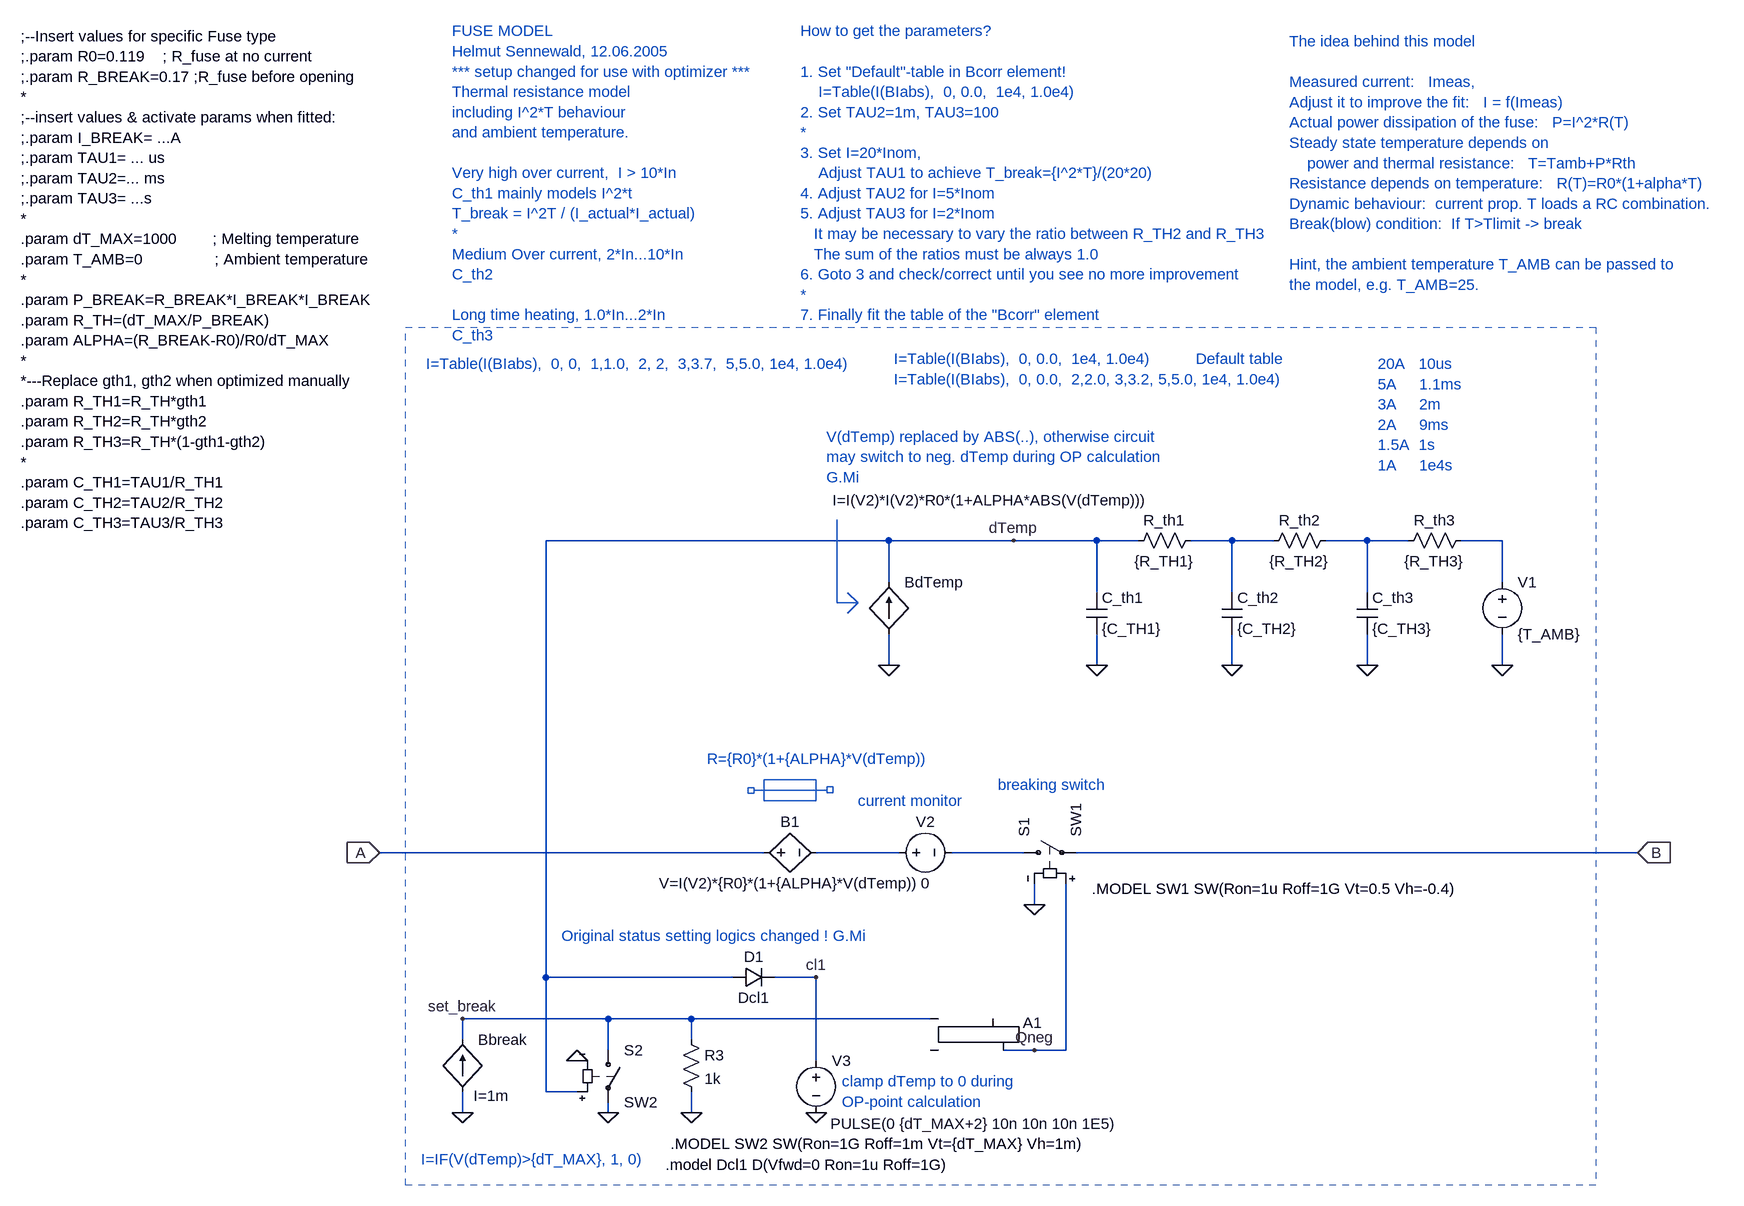
[diagram p0: schematic Fuse_Model_NN.asc]
Fuse_Model_NN.asc, the LTspice schematic file:
Version 4
SHEET 1 2036 932
WIRE -96 368 -96 336
WIRE -96 480 -96 448
WIRE 32 272 32 -400
WIRE 32 448 32 272
WIRE 80 448 32 448
WIRE 128 336 -96 336
WIRE 128 384 128 336
WIRE 128 480 128 464
WIRE 256 336 128 336
WIRE 256 368 256 336
WIRE 256 480 256 448
WIRE 320 272 32 272
WIRE 368 80 -224 80
WIRE 448 272 384 272
WIRE 448 400 448 272
WIRE 560 -400 32 -400
WIRE 560 -336 560 -400
WIRE 560 -208 560 -256
WIRE 576 80 448 80
WIRE 624 336 256 336
WIRE 752 -400 560 -400
WIRE 768 80 656 80
WIRE 784 160 784 128
WIRE 784 384 736 384
WIRE 832 384 784 384
WIRE 832 384 832 128
WIRE 880 -400 752 -400
WIRE 880 -320 880 -400
WIRE 880 -208 880 -256
WIRE 944 -400 880 -400
WIRE 1088 -400 1024 -400
WIRE 1088 -320 1088 -400
WIRE 1088 -208 1088 -256
WIRE 1152 -400 1088 -400
WIRE 1296 -400 1232 -400
WIRE 1296 -320 1296 -400
WIRE 1296 -208 1296 -256
WIRE 1360 -400 1296 -400
WIRE 1504 -400 1440 -400
WIRE 1504 -336 1504 -400
WIRE 1504 -208 1504 -256
WIRE 1712 80 848 80
FLAG 560 -208 0
FLAG 784 160 0
FLAG 752 -400 dTemp
FLAG 880 -208 0
FLAG 1296 -208 0
FLAG 1088 -208 0
FLAG -96 480 0
FLAG 256 480 0
FLAG -96 336 set_break
FLAG 1504 -208 0
FLAG -224 80 A
IOPIN -224 80 In
FLAG 1712 80 B
IOPIN 1712 80 In
FLAG 784 384 Qneg
FLAG 128 480 0
FLAG 448 480 0
FLAG 80 400 0
FLAG 448 272 cl1
SYMBOL voltage 560 80 R270
WINDOW 0 32 56 VTop 0
WINDOW 3 -32 56 VBottom 0
SYMATTR InstName V2
SYMATTR Value 0
SYMBOL bi2 560 -336 R0
WINDOW 3 -87 -126 Left 0
SYMATTR Value I=I(V2)*I(V2)*R0*(1+ALPHA*ABS(V(dTemp)))
SYMATTR InstName BdTemp
SYMBOL res 928 -384 R270
WINDOW 0 32 56 VTop 0
WINDOW 3 0 56 VBottom 0
SYMATTR InstName R_th1
SYMATTR Value {R_TH1}
SYMBOL cap 864 -320 R0
SYMATTR InstName C_th1
SYMATTR Value {C_TH1}
SYMBOL sw 752 80 R270
SYMATTR InstName S1
SYMATTR Value SW1
SYMBOL res 1136 -384 R270
WINDOW 0 32 56 VTop 0
WINDOW 3 0 56 VBottom 0
SYMATTR InstName R_th2
SYMATTR Value {R_TH2}
SYMBOL cap 1072 -320 R0
SYMATTR InstName C_th2
SYMATTR Value {C_TH2}
SYMBOL Digital\\srflop 672 288 R0
SYMATTR InstName A1
SYMBOL cap 1280 -320 R0
SYMATTR InstName C_th3
SYMATTR Value {C_TH3}
SYMBOL bi2 -96 368 R0
WINDOW 3 17 86 Left 0
SYMATTR Value I=1m
SYMATTR InstName Bbreak
SYMBOL res 240 352 R0
SYMATTR InstName R3
SYMATTR Value 1k
SYMBOL res 1344 -384 R270
WINDOW 0 32 56 VTop 0
WINDOW 3 0 56 VBottom 0
SYMATTR InstName R_th3
SYMATTR Value {R_TH3}
SYMBOL bv 352 80 R270
WINDOW 0 32 56 VTop 0
WINDOW 3 -32 56 VBottom 0
SYMATTR InstName B1
SYMATTR Value V=I(V2)*{R0}*(1+{ALPHA}*V(dTemp))
SYMBOL voltage 1504 -352 R0
SYMATTR InstName V1
SYMATTR Value {T_AMB}
SYMBOL sw 128 368 R0
SYMATTR InstName S2
SYMATTR Value SW2
SYMBOL voltage 448 384 R0
WINDOW 123 0 0 Left 0
WINDOW 39 0 0 Left 0
WINDOW 3 22 113 Left 0
SYMATTR Value PULSE(0 {dT_MAX+2} 10n 10n 10n 1E5)
SYMATTR InstName V3
SYMBOL diode 320 288 R270
WINDOW 0 32 32 VTop 0
WINDOW 3 0 32 VBottom 0
SYMATTR InstName D1
SYMATTR Value Dcl1
TEXT 872 136 Left 0 !.MODEL SW1 SW(Ron=1u Roff=1G Vt=0.5 Vh=-0.4)
TEXT -112 -1184 Left 0 ;FUSE MODEL\nHelmut Sennewald, 12.06.2005\n*** setup changed for use with optimizer ***\nThermal resistance model \nincluding I^2*T behaviour \nand ambient temperature.\n \nVery high over current,  I > 10*In\nC_th1 mainly models I^2*t \nT_break = I^2T / (I_actual*I_actual)\n*\nMedium Over current, 2*In...10*In\nC_th2 \n \nLong time heating, 1.0*In...2*In\nC_th3
TEXT 568 -648 Left 0 ;I=Table(I(BIabs),  0, 0.0,  2,2.0, 3,3.2, 5,5.0, 1e4, 1.0e4)
TEXT 568 -680 Left 0 ;I=Table(I(BIabs),  0, 0.0,  1e4, 1.0e4)
TEXT 1032 -680 Left 0 ;Default table
TEXT 280 -64 Left 0 ;R={R0}*(1+{ALPHA}*V(dTemp))
TEXT 512 0 Left 0 ;current monitor
TEXT 728 -24 Left 0 ;breaking switch
TEXT 424 -1184 Left 0 ;How to get the parameters?\n \n1. Set "Default"-table in Bcorr element!\n    I=Table(I(BIabs),  0, 0.0,  1e4, 1.0e4)\n2. Set TAU2=1m, TAU3=100\n*\n3. Set I=20*Inom, \n    Adjust TAU1 to achieve T_break={I^2*T}/(20*20)\n4. Adjust TAU2 for I=5*Inom\n5. Adjust TAU3 for I=2*Inom\n   It may be necessary to vary the ratio between R_TH2 and R_TH3\n   The sum of the ratios must be always 1.0\n6. Goto 3 and check/correct until you see no more improvement\n*\n7. Finally fit the table of the "Bcorr" element
TEXT -776 -1176 Left 0 !;--Insert values for specific Fuse type\n;.param R0=0.119    ; R_fuse at no current\n;.param R_BREAK=0.17 ;R_fuse before opening\n*\n;--insert values & activate params when fitted:\n;.param I_BREAK= ...A\n;.param TAU1= ... us\n;.param TAU2=... ms\n;.param TAU3= ...s\n*\n.param dT_MAX=1000        ; Melting temperature\n.param T_AMB=0                ; Ambient temperature\n*\n.param P_BREAK=R_BREAK*I_BREAK*I_BREAK\n.param R_TH=(dT_MAX/P_BREAK)\n.param ALPHA=(R_BREAK-R0)/R0/dT_MAX\n*\n*---Replace gth1, gth2 when optimized manually\n.param R_TH1=R_TH*gth1\n.param R_TH2=R_TH*gth2\n.param R_TH3=R_TH*(1-gth1-gth2)\n*\n.param C_TH1=TAU1/R_TH1\n.param C_TH2=TAU2/R_TH2\n.param C_TH3=TAU3/R_TH3
TEXT -152 -672 Left 0 ;I=Table(I(BIabs),  0, 0,  1,1.0,  2, 2,  3,3.7,  5,5.0, 1e4, 1.0e4)
TEXT 1312 -672 Left 0 ;20A   10us\n5A     1.1ms\n3A     2m\n2A     9ms\n1.5A  1s\n1A     1e4s
TEXT 1176 -1168 Left 0 ;The idea behind this model\n \nMeasured current:   Imeas,       \nAdjust it to improve the fit:   I = f(Imeas)      \nActual power dissipation of the fuse:   P=I^2*R(T) \nSteady state temperature depends on \n    power and thermal resistance:   T=Tamb+P*Rth    \nResistance depends on temperature:   R(T)=R0*(1+alpha*T)   \nDynamic behaviour:  current prop. T loads a RC combination. \nBreak(blow) condition:  If T>Tlimit -> break\n \nHint, the ambient temperature T_AMB can be passed to\nthe model, e.g. T_AMB=25.
TEXT -160 552 Left 0 ;I=IF(V(dTemp)>{dT_MAX}, 1, 0)
TEXT 224 528 Left 0 !.MODEL SW2 SW(Ron=1G Roff=1m Vt={dT_MAX} Vh=1m)
TEXT 216 560 Left 0 !.model Dcl1 D(Vfwd=0 Ron=1u Roff=1G)
TEXT 488 432 Left 0 ;clamp dTemp to 0 during\nOP-point calculation
TEXT 56 208 Left 0 ;Original status setting logics changed ! G.Mi
TEXT 464 -560 Left 0 ;V(dTemp) replaced by ABS(..), otherwise circuit\nmay switch to neg. dTemp during OP calculation\nG.Mi
LINE Normal 480 -432 480 -432
LINE Normal 480 -304 480 -432
LINE Normal 512 -304 480 -304
LINE Normal 496 -320 512 -304
LINE Normal 496 -288 512 -304
LINE Normal 464 -16 352 -16
RECTANGLE Normal 1648 592 -184 -728 2
RECTANGLE Normal 448 0 368 -32
RECTANGLE Normal 474 -12 465 -21
RECTANGLE Normal 352 -11 343 -20

The netlist it stands for:
* Fuse_Model_NN.asc
V2 N001 N002 0
BdTemp 0 dTemp I=I(V2)*I(V2)*R0*(1+ALPHA*ABS(V(dTemp)))
R_th1 dTemp N003 {R_TH1}
C_th1 dTemp 0 {C_TH1}
S1 N002 B Qneg 0 SW1
R_th2 N003 N004 {R_TH2}
C_th2 N003 0 {C_TH2}
A1 set_break 0 0 0 0 Qneg 0 0 SRFLOP
C_th3 N004 0 {C_TH3}
Bbreak 0 set_break I=1m
R3 set_break 0 1k
R_th3 N004 N005 {R_TH3}
B1 A N001 V=I(V2)*{R0}*(1+{ALPHA}*V(dTemp))
V1 N005 0 {T_AMB}
S2 set_break 0 dTemp 0 SW2
V3 cl1 0 PULSE(0 {dT_MAX+2} 10n 10n 10n 1E5)
D1 dTemp cl1 Dcl1
.model D D
.lib standard.dio
.MODEL SW1 SW(Ron=1u Roff=1G Vt=0.5 Vh=-0.4)
* FUSE MODEL
* Helmut Sennewald, 12.06.2005
* *** setup changed for use with optimizer ***
* Thermal resistance model
* including I^2*T behaviour
* and ambient temperature.
* Very high over current,  I > 10*In
* C_th1 mainly models I^2*t
* T_break = I^2T / (I_actual*I_actual)
* *
* Medium Over current, 2*In...10*In
* C_th2
* Long time heating, 1.0*In...2*In
* C_th3
* I=Table(I(BIabs),  0, 0.0,  2,2.0, 3,3.2, 5,5.0, 1e4, 1.0e4)
* I=Table(I(BIabs),  0, 0.0,  1e4, 1.0e4)
* Default table
* R={R0}*(1+{ALPHA}*V(dTemp))
* current monitor
* breaking switch
* How to get the parameters?
* 1. Set "Default"-table in Bcorr element!
*     I=Table(I(BIabs),  0, 0.0,  1e4, 1.0e4)
* 2. Set TAU2=1m, TAU3=100
* *
* 3. Set I=20*Inom,
*     Adjust TAU1 to achieve T_break={I^2*T}/(20*20)
* 4. Adjust TAU2 for I=5*Inom
* 5. Adjust TAU3 for I=2*Inom
*    It may be necessary to vary the ratio between R_TH2 and R_TH3
*    The sum of the ratios must be always 1.0
* 6. Goto 3 and check/correct until you see no more improvement
* *
* 7. Finally fit the table of the "Bcorr" element
;--Insert values for specific Fuse type
;.param R0=0.119    ; R_fuse at no current
;.param R_BREAK=0.17 ;R_fuse before opening
*
;--insert values & activate params when fitted:
;.param I_BREAK= ...A
;.param TAU1= ... us
;.param TAU2=... ms
;.param TAU3= ...s
*
.param dT_MAX=1000        ; Melting temperature
.param T_AMB=0                ; Ambient temperature
*
.param P_BREAK=R_BREAK*I_BREAK*I_BREAK
.param R_TH=(dT_MAX/P_BREAK)
.param ALPHA=(R_BREAK-R0)/R0/dT_MAX
*
*---Replace gth1, gth2 when optimized manually
.param R_TH1=R_TH*gth1
.param R_TH2=R_TH*gth2
.param R_TH3=R_TH*(1-gth1-gth2)
*
.param C_TH1=TAU1/R_TH1
.param C_TH2=TAU2/R_TH2
.param C_TH3=TAU3/R_TH3
* I=Table(I(BIabs),  0, 0,  1,1.0,  2, 2,  3,3.7,  5,5.0, 1e4, 1.0e4)
* 20A   10us
* 5A     1.1ms
* 3A     2m
* 2A     9ms
* 1.5A  1s
* 1A     1e4s
* The idea behind this model
* Measured current:   Imeas,
* Adjust it to improve the fit:   I = f(Imeas)
* Actual power dissipation of the fuse:   P=I^2*R(T)
* Steady state temperature depends on
*     power and thermal resistance:   T=Tamb+P*Rth
* Resistance depends on temperature:   R(T)=R0*(1+alpha*T)
* Dynamic behaviour:  current prop. T loads a RC combination.
* Break(blow) condition:  If T>Tlimit -> break
* Hint, the ambient temperature T_AMB can be passed to
* the model, e.g. T_AMB=25.
* I=IF(V(dTemp)>{dT_MAX}, 1, 0)
.MODEL SW2 SW(Ron=1G Roff=1m Vt={dT_MAX} Vh=1m)
.model Dcl1 D(Vfwd=0 Ron=1u Roff=1G)
* clamp dTemp to 0 during
* OP-point calculation
* Original status setting logics changed ! G.Mi
* V(dTemp) replaced by ABS(..), otherwise circuit
* may switch to neg. dTemp during OP calculation
* G.Mi
.backanno
.end